# Altium schematic sheet sch_cm4_ethernet.SchDoc
size A4; SheetNumber: 2; SheetTotal: 6
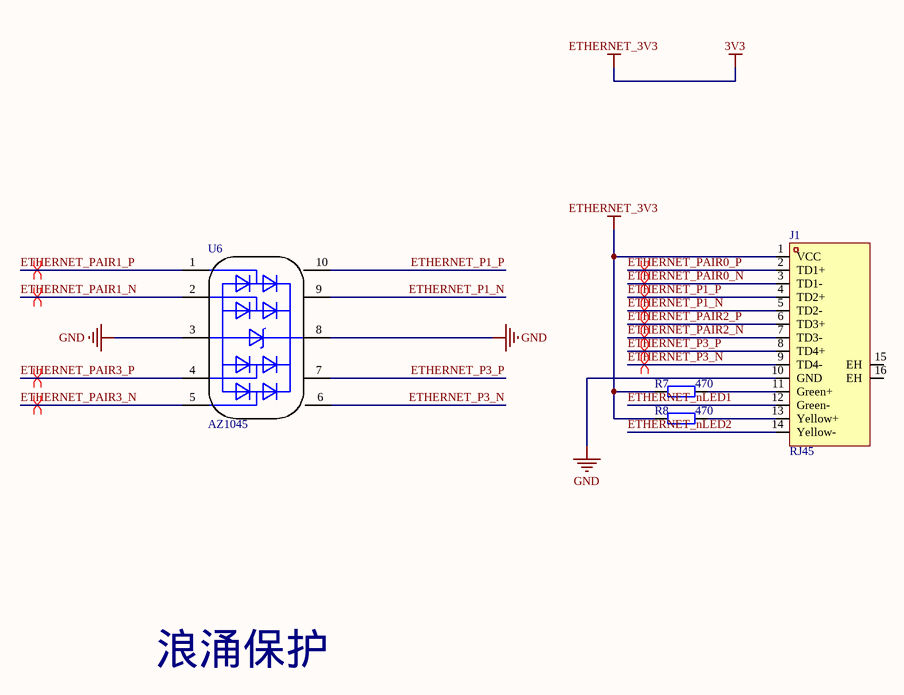
[diagram p0: sch_cm4_ethernet.SchDoc]

## Parts
J1  RJ45  [RJ45]
R7  470  [R 0603_L]
R8  470  [R 0603_L]
U6  AZ1045  [AZ1045-04F]

## Nets
3V3: J1.1(VCC) R7.1 R8.1  [also labelled ETHERNET_3V3]
GND: J1.10(GND) U6.3(GND) U6.8(GND)
ETHERNET_nLED1: J1.12(Green-)
ETHERNET_nLED2: J1.14(Yellow-)
ETHERNET_P1_N: J1.5(TD2-) U6.9(NC)
ETHERNET_P1_P: J1.4(TD2+) U6.10(NC)
ETHERNET_P3_N: J1.9(TD4-) U6.6(NC)
ETHERNET_P3_P: J1.8(TD4+) U6.7(NC)
ETHERNET_PAIR0_N: J1.3(TD1-)
ETHERNET_PAIR0_P: J1.2(TD1+)
ETHERNET_PAIR1_N: U6.2(I/O_2)
ETHERNET_PAIR1_P: U6.1(I/O_1)
ETHERNET_PAIR2_N: J1.7(TD3-)
ETHERNET_PAIR2_P: J1.6(TD3+)
ETHERNET_PAIR3_N: U6.5(I/O_4)
ETHERNET_PAIR3_P: U6.4(I/O_3)
NetJ1_11: J1.11(Green+) R7.2
NetJ1_13: J1.13(Yellow+) R8.2

Not connected (* = marked no-connect by the designer): J1 15(EH) 16(EH)

## Layout directives
differential pair: ETHERNET_P1_N, ETHERNET_P1_P, ETHERNET_P3_N, ETHERNET_P3_P, ETHERNET_PAIR0_N, ETHERNET_PAIR0_P, ETHERNET_PAIR1_N, ETHERNET_PAIR1_P, ETHERNET_PAIR2_N, ETHERNET_PAIR2_P, ETHERNET_PAIR3_N, ETHERNET_PAIR3_P

## Notes on the sheet
- 浪涌保护

## Library data of the parts
R7 R8 = R: 贴片电阻; 版权归属: 来自淘宝 ID：黄晶宝石; 封装库来自淘宝卖家 ID：黄晶宝石: 其他店铺购入均为盗版，不享受售后技术支持服务，请立即申请退款; BOM名称: 贴片电阻; 联系售后: https://item.taobao.com/item.htm?id=566775463719